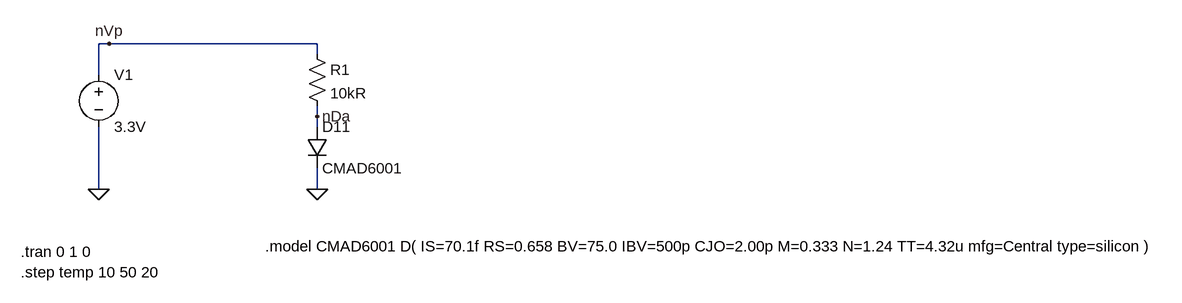
[diagram p0: schematic BiTuner_TempDiode.asc]
BiTuner_TempDiode.asc, the LTspice schematic file:
Version 4
SHEET 1 1136 680
WIRE -640 -96 -656 -96
WIRE -320 -96 -640 -96
WIRE -320 -80 -320 -96
WIRE -656 -48 -656 -96
WIRE -320 16 -320 0
WIRE -320 32 -320 16
WIRE -656 128 -656 32
WIRE -320 128 -320 96
FLAG -656 128 0
FLAG -640 -96 nVp
FLAG -320 128 0
FLAG -320 16 nDa
SYMBOL diode -336 32 R0
SYMATTR InstName D11
SYMATTR Value CMAD6001
SYMBOL voltage -656 -64 R0
WINDOW 123 0 0 Left 0
WINDOW 39 0 0 Left 0
SYMATTR InstName V1
SYMATTR Value 3.3V
SYMBOL res -336 -96 R0
SYMATTR InstName R1
SYMATTR Value 10kR
TEXT -776 256 Left 2 !.step temp 10 50 20
TEXT -776 224 Left 2 !.tran 0 1 0
TEXT -400 216 Left 2 !.model CMAD6001 D( IS=70.1f RS=0.658 BV=75.0 IBV=500p CJO=2.00p M=0.333 N=1.24 TT=4.32u mfg=Central type=silicon )

The netlist it stands for:
* BiTuner_TempDiode.asc
D11 nDa 0 CMAD6001
V1 nVp 0 3.3V
R1 nVp nDa 10kR
.model D D
.lib standard.dio
.step temp 10 50 20
.tran 0 1 0
.model CMAD6001 D( IS=70.1f RS=0.658 BV=75.0 IBV=500p CJO=2.00p M=0.333 N=1.24 TT=4.32u mfg=Central type=silicon )
.backanno
.end

* Results of the author's LTspice run, read from the files saved beside the schematic
* Operating Point (first step), zero values left out:
*   temperature = 10 
*   V(nda) = 733.6 mV
*   V(nvp) = 3.3 V
*   I(D11) = 256.6 µA
*   I(R1) = 256.6 µA
*   I(V1) = -256.6 µA
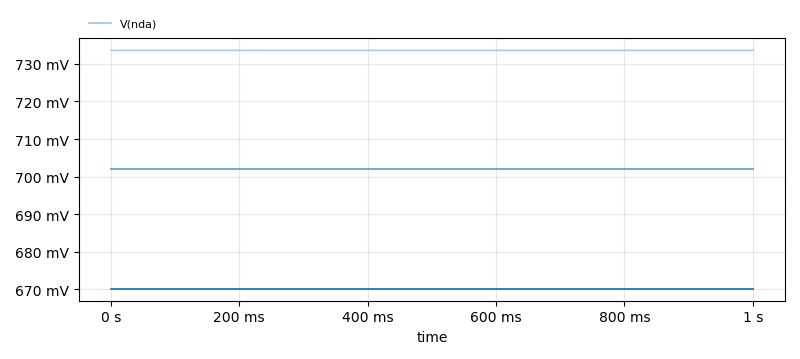
[diagram p1: Transient Analysis of BiTuner_TempDiode.asc, plotted from the saved traces]
* Transient Analysis, 3 runs:
*   V(nda) [run 1]: min 733.6 mV, max 733.6 mV, average 733.6 mV, rms 733.6 mV, last 733.6 mV
*   V(nda) [run 2]: min 702 mV, max 702 mV, average 702 mV, rms 702 mV, last 702 mV
*   V(nda) [run 3]: min 670.2 mV, max 670.2 mV, average 670.2 mV, rms 670.2 mV, last 670.2 mV